# Altium schematic sheet MIPI Interface and Parallel Display Interface.SchDoc
size A3; Company Name: Renesas Electronics America; CompanyURL: www.renesas.com; PageSetup: Record=PageOptions|CenterHorizontal=True|CenterVertical=True|PrintScale=1.00|XCorrection=1.00|YCorrection=1.00|PrintKind=1|BorderSize=5000000|LeftOffset=0|BottomOffset=0|Orientation=2|PaperLength=1000|PaperWidth=1000|Scale=100|PaperSource=7|PrintQuality=-4|MediaType=1|DitherType=10|PaperKind=A5 148x210mm|PrintScaleMode=1; ReleaseDate: 16.09.2025; Version: MP; SheetNumber: 16; SheetTotal: 18; VariantNumber: 0; DSheetNumber: 1
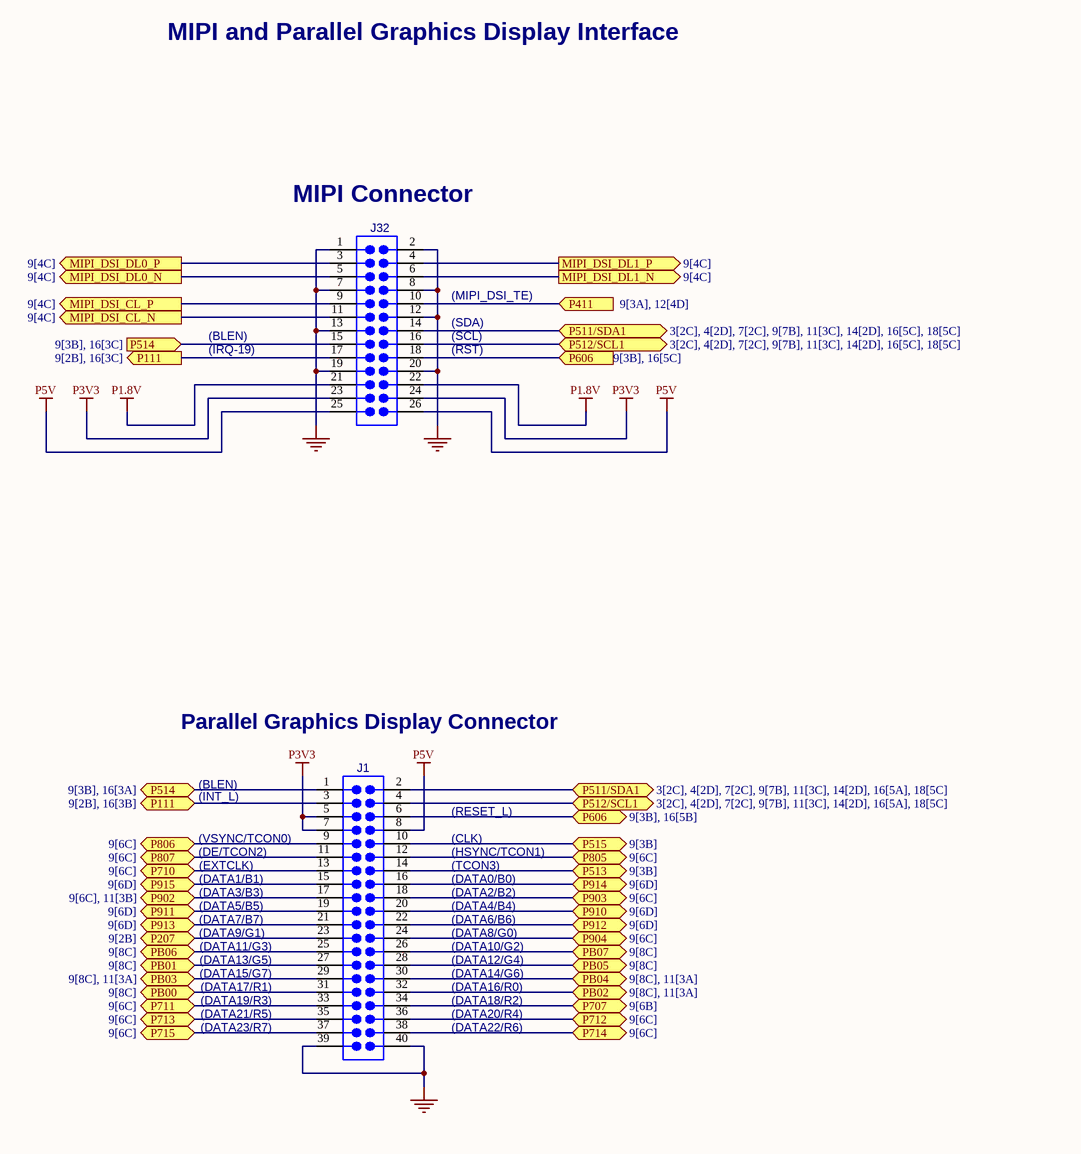
[diagram p0: MIPI Interface and Parallel Display Interface.SchDoc]

## Parts
J1  95157-240LF  [amp_95157-240LF]  (value not drawn)
J32  CON_026  [sam_ERF8-013-05.0-L-DV-TR]  (value not drawn)

## Ports
MIPI_DSI_CL_N (out, see 9[4C]), MIPI_DSI_CL_P (out, see 9[4C]), MIPI_DSI_DL0_N (out, see 9[4C]), MIPI_DSI_DL0_P (out, see 9[4C]), MIPI_DSI_DL1_N (out, see 9[4C]), MIPI_DSI_DL1_P (out, see 9[4C]), P111 (bidir, see 9[2B], 16[3B]), P111 (out, see 9[2B], 16[3C]), P207 (bidir, see 9[2B]), P411 (in, see 9[3A], 12[4D]), P511/SDA1 (bidir, see 3[2C], 4[2D], 7[2C], 9[7B], 11[3C], 14[2D], 16[5A], 18[5C]), P511/SDA1 (bidir, see 3[2C], 4[2D], 7[2C], 9[7B], 11[3C], 14[2D], 16[5C], 18[5C]), P512/SCL1 (bidir, see 3[2C], 4[2D], 7[2C], 9[7B], 11[3C], 14[2D], 16[5A], 18[5C]), P512/SCL1 (bidir, see 3[2C], 4[2D], 7[2C], 9[7B], 11[3C], 14[2D], 16[5C], 18[5C]), P513 (bidir, see 9[3B]), P514 (bidir, see 9[3B], 16[3A]), P514 (in, see 9[3B], 16[3C]), P515 (bidir, see 9[3B]), P606 (bidir, see 9[3B], 16[5B]), P606 (in, see 9[3B], 16[5C]), P707 (bidir, see 9[6B]), P710 (bidir, see 9[6C]), P711 (bidir, see 9[6C]), P712 (bidir, see 9[6C]), P713 (bidir, see 9[6C]), P714 (bidir, see 9[6C]), P715 (bidir, see 9[6C]), P805 (bidir, see 9[6C]), P806 (bidir, see 9[6C]), P807 (bidir, see 9[6C]), P902 (bidir, see 9[6C], 11[3B]), P903 (bidir, see 9[6C]), P904 (bidir, see 9[6C]), P910 (bidir, see 9[6D]), P911 (bidir, see 9[6D]), P912 (bidir, see 9[6D]), P913 (bidir, see 9[6D]), P914 (bidir, see 9[6D]), P915 (bidir, see 9[6D]), PB00 (bidir, see 9[8C]), PB01 (bidir, see 9[8C]), PB02 (bidir, see 9[8C], 11[3A]), PB03 (bidir, see 9[8C], 11[3A]), PB04 (bidir, see 9[8C], 11[3A]), PB05 (bidir, see 9[8C]), PB06 (bidir, see 9[8C]), PB07 (bidir, see 9[8C])

## Nets
GND: J1.39 J1.40 J32.1 J32.2 J32.7 J32.8 J32.12 J32.13 J32.19 J32.20
P1.8V: J32.21 J32.22
P3V3: J1.5 J1.7 J32.23 J32.24
P5V: J1.8 J32.25 J32.26
MIPI_DSI_CL_N: J32.11 ; port MIPI_DSI_CL_N
MIPI_DSI_CL_P: J32.9 ; port MIPI_DSI_CL_P
MIPI_DSI_DL0_N: J32.5 ; port MIPI_DSI_DL0_N
MIPI_DSI_DL0_P: J32.3 ; port MIPI_DSI_DL0_P
MIPI_DSI_DL1_N: J32.6 ; port MIPI_DSI_DL1_N
MIPI_DSI_DL1_P: J32.4 ; port MIPI_DSI_DL1_P
P111: J1.3 J32.17 ; port P111
P207: J1.23 ; port P207
P411: J32.10 ; port P411
P511/SDA1: J1.2 J32.14 ; port P511/SDA1
P512/SCL1: J1.4 J32.16 ; port P512/SCL1
P513: J1.14 ; port P513
P514: J1.1 J32.15 ; port P514
P515: J1.10 ; port P515
P606: J1.6 J32.18 ; port P606
P707: J1.34 ; port P707
P710: J1.13 ; port P710
P711: J1.33 ; port P711
P712: J1.36 ; port P712
P713: J1.35 ; port P713
P714: J1.38 ; port P714
P715: J1.37 ; port P715
P805: J1.12 ; port P805
P806: J1.9 ; port P806
P807: J1.11 ; port P807
P902: J1.17 ; port P902
P903: J1.18 ; port P903
P904: J1.24 ; port P904
P910: J1.20 ; port P910
P911: J1.19 ; port P911
P912: J1.22 ; port P912
P913: J1.21 ; port P913
P914: J1.16 ; port P914
P915: J1.15 ; port P915
PB00: J1.31 ; port PB00
PB01: J1.27 ; port PB01
PB02: J1.32 ; port PB02
PB03: J1.29 ; port PB03
PB04: J1.30 ; port PB04
PB05: J1.28 ; port PB05
PB06: J1.25 ; port PB06
PB07: J1.26 ; port PB07

## Notes on the sheet
- MIPI and Parallel Graphics Display Interface
- (near J32) MIPI Connector
- (BLEN)
- (IRQ-19)
- (SDA)
- (SCL)
- (RST)
- (MIPI_DSI_TE)
- Parallel Graphics Display Connector
- (INT_L)
- (RESET_L)
- (EXTCLK)
- (DATA1/B1)
- (DATA3/B3)
- (DE/TCON2)
- (near J1) (VSYNC/TCON0)
- (HSYNC/TCON1)
- (CLK)
- (DATA0/B0)
- (DATA2/B2)
- (TCON3)
- (DATA5/B5)
- (DATA7/B7)
- (DATA9/G1)
- (DATA13/G5)
- (DATA11/G3)
- (DATA4/B4)
- (DATA10/G2)
- (DATA12/G4)
- (DATA6/B6)
- (DATA8/G0)
- (DATA15/G7)
- (DATA21/R5)
- (DATA23/R7)
- (DATA17/R1)
- (DATA19/R3)
- (DATA20/R4)
- (DATA16/R0)
- (DATA14/G6)
- (DATA18/R2)
- (DATA22/R6)
- www.renesas.com <http://www.renesas.com>
- Sheet:
- Title:
- Document Number:
- Version:
- Variant:
- Renesas Electronics
- Size:
- A3
- Date:
- Time:
- Page:
- of
- Product Issue:

## Library data of the parts
J1 = CON-00000093-4: Header,40way,2row,vertical,2.54mm,SMT; Current: 3A; Gender: male; Height: 9.98mm; Operating Temperature Max: 125°C; Operating Temperature Min: -65°C; Pin Count: 40; Qualification: -
J32 = CON-00003434-15: Edge Rate Rugged High Speed Socket/Terminal Strip; Gender: female; Current: 1.4A; DC Resistance: 15m; Operating Voltage Max: 225V; Height: 5.1mm; Operating Temperature Max: 125°C; Operating Temperature Min: -55°C; Pin Count: 26; Qualification: -